# EAGLE design Keypad (EAGLE 7.7.0)

## Sheet 1 of 2
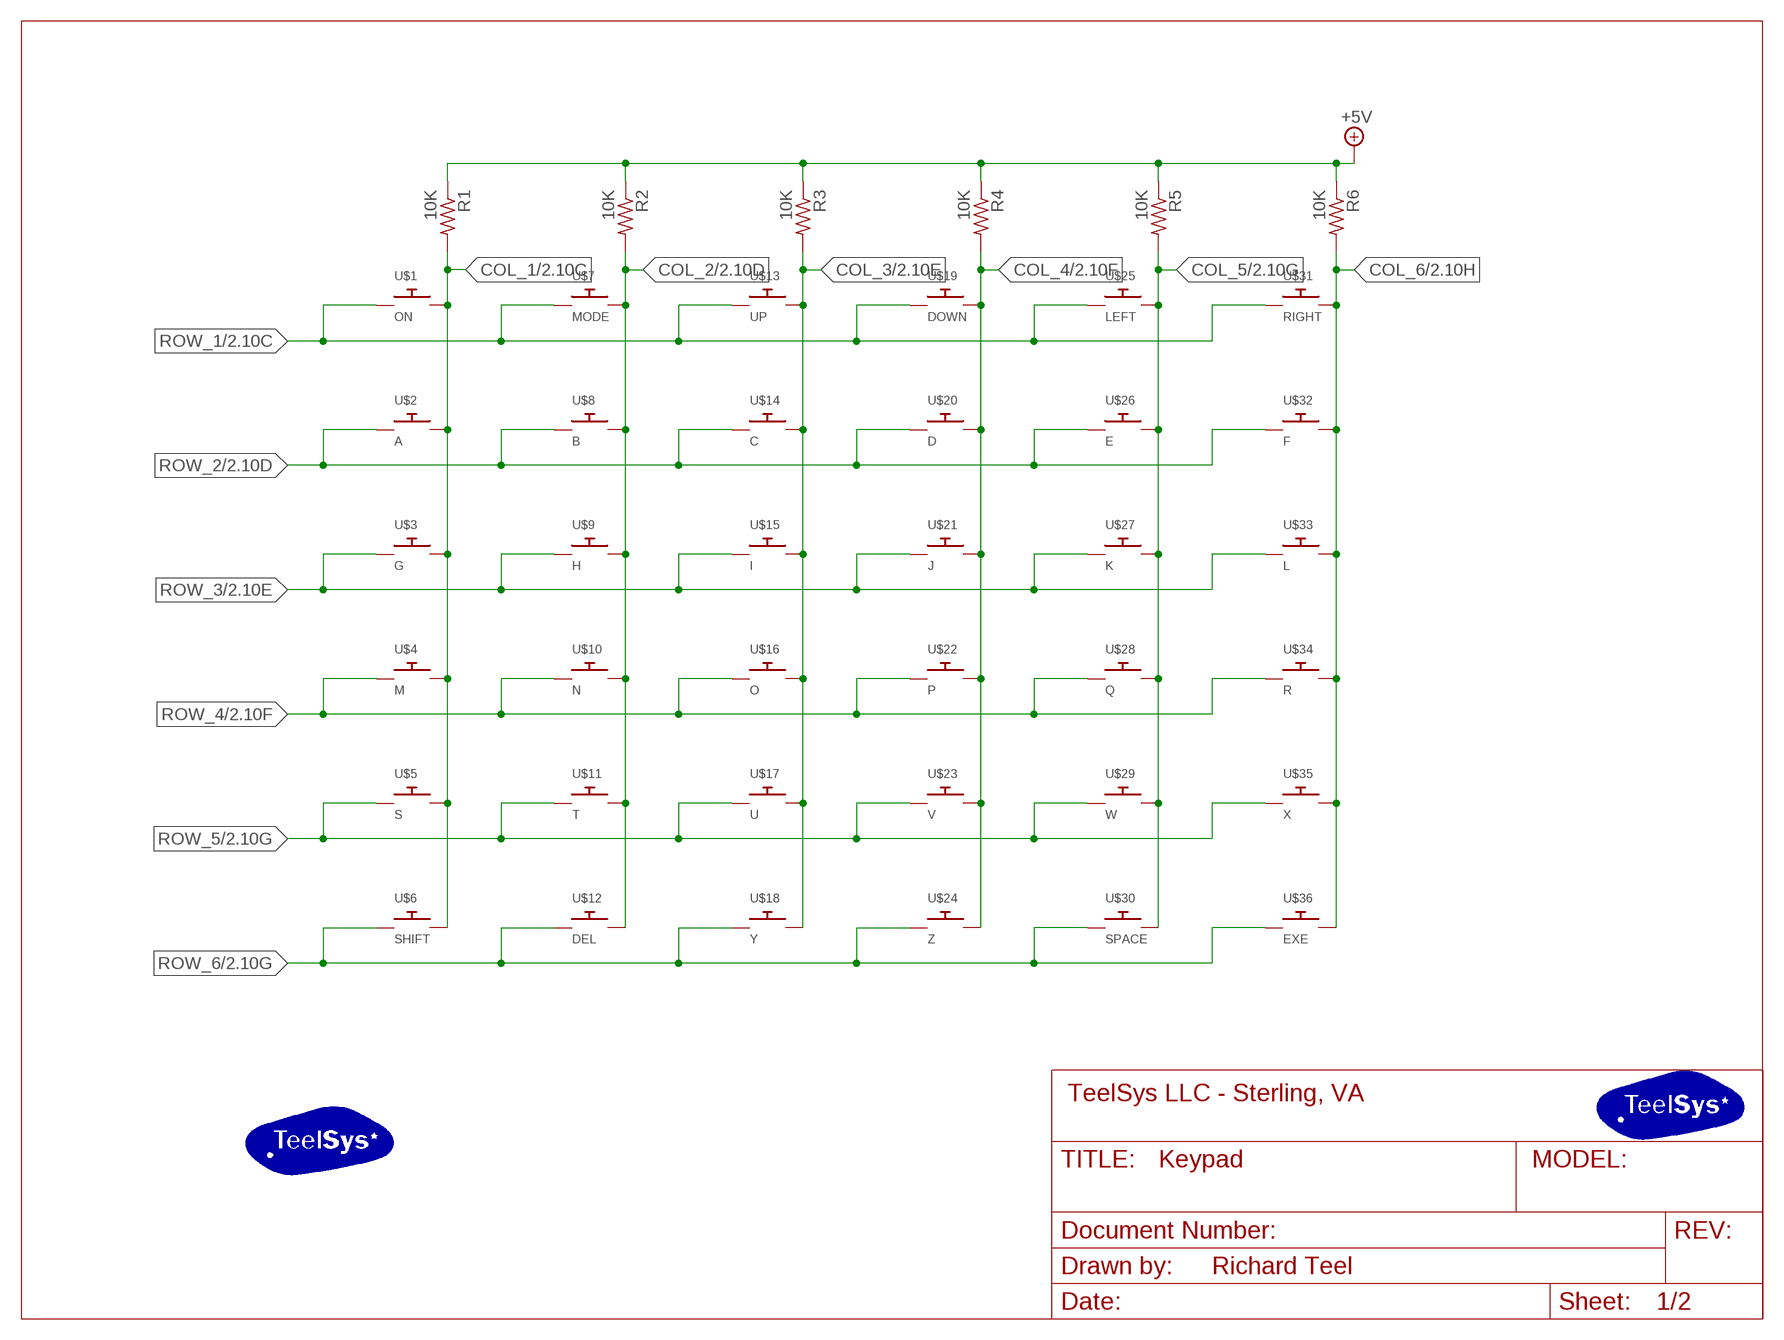
[diagram p0: schematic, sheet 1]
FRAME1 (LETTER_L): COMPANY_INFO: TeelSys LLC - Sterling, VA; DRAWN_BY: Richard Teel

### Parts
R1  10K  R-US_M0805  [M0805]
R2  10K  R-US_M0805  [M0805]
R3  10K  R-US_M0805  [M0805]
R4  10K  R-US_M0805  [M0805]
R5  10K  R-US_M0805  [M0805]
R6  10K  R-US_M0805  [M0805]
U$1  ON  KEYPAD  [KEYPAD_RND]
U$2  A  KEYPAD  [KEYPAD_RND]
U$3  G  KEYPAD  [KEYPAD_RND]
U$4  M  KEYPAD  [KEYPAD_RND]
U$5  S  KEYPAD  [KEYPAD_RND]
U$6  SHIFT  KEYPAD  [KEYPAD_RND]
U$7  MODE  KEYPAD  [KEYPAD_RND]
U$8  B  KEYPAD  [KEYPAD_RND]
U$9  H  KEYPAD  [KEYPAD_RND]
U$10  N  KEYPAD  [KEYPAD_RND]
U$11  T  KEYPAD  [KEYPAD_RND]
U$12  DEL  KEYPAD  [KEYPAD_RND]
U$13  UP  KEYPAD  [KEYPAD_RND]
U$14  C  KEYPAD  [KEYPAD_RND]
U$15  I  KEYPAD  [KEYPAD_RND]
U$16  O  KEYPAD  [KEYPAD_RND]
U$17  U  KEYPAD  [KEYPAD_RND]
U$18  Y  KEYPAD  [KEYPAD_RND]
U$19  DOWN  KEYPAD  [KEYPAD_RND]
U$20  D  KEYPAD  [KEYPAD_RND]
U$21  J  KEYPAD  [KEYPAD_RND]
U$22  P  KEYPAD  [KEYPAD_RND]
U$23  V  KEYPAD  [KEYPAD_RND]
U$24  Z  KEYPAD  [KEYPAD_RND]
U$25  LEFT  KEYPAD  [KEYPAD_RND]
U$26  E  KEYPAD  [KEYPAD_RND]
U$27  K  KEYPAD  [KEYPAD_RND]
U$28  Q  KEYPAD  [KEYPAD_RND]
U$29  W  KEYPAD  [KEYPAD_RND]
U$30  SPACE  KEYPAD  [KEYPAD_RND]
U$31  RIGHT  KEYPAD  [KEYPAD_RND]
U$32  F  KEYPAD  [KEYPAD_RND]
U$33  L  KEYPAD  [KEYPAD_RND]
U$34  R  KEYPAD  [KEYPAD_RND]
U$35  X  KEYPAD  [KEYPAD_RND]
U$36  EXE  KEYPAD  [KEYPAD_RND]
U$40  TEELSYS_LOGO_ART_2BOTTOM  [TEELSYS_LOGO_ART_BOTTOM_2]

### Nets
+5V: R1.1 R2.1 R3.1 R4.1 R5.1 R6.1 ; also sheet 2
COL_1: R1.2 U$1.P$2 U$2.P$2 U$3.P$2 U$4.P$2 U$5.P$2 U$6.P$2 ; also sheet 2
COL_2: R2.2 U$7.P$2 U$8.P$2 U$9.P$2 U$10.P$2 U$11.P$2 U$12.P$2 ; also sheet 2
COL_3: R3.2 U$13.P$2 U$14.P$2 U$15.P$2 U$16.P$2 U$17.P$2 U$18.P$2 ; also sheet 2
COL_4: R4.2 U$19.P$2 U$20.P$2 U$21.P$2 U$22.P$2 U$23.P$2 U$24.P$2 ; also sheet 2
COL_5: R5.2 U$25.P$2 U$26.P$2 U$27.P$2 U$28.P$2 U$29.P$2 U$30.P$2 ; also sheet 2
COL_6: R6.2 U$31.P$2 U$32.P$2 U$33.P$2 U$34.P$2 U$35.P$2 U$36.P$2 ; also sheet 2
ROW_1: U$1.P$1 U$7.P$1 U$13.P$1 U$19.P$1 U$25.P$1 U$31.P$1 ; also sheet 2
ROW_2: U$2.P$1 U$8.P$1 U$14.P$1 U$20.P$1 U$26.P$1 U$32.P$1 ; also sheet 2
ROW_3: U$3.P$1 U$9.P$1 U$15.P$1 U$21.P$1 U$27.P$1 U$33.P$1 ; also sheet 2
ROW_4: U$4.P$1 U$10.P$1 U$16.P$1 U$22.P$1 U$28.P$1 U$34.P$1 ; also sheet 2
ROW_5: U$5.P$1 U$11.P$1 U$17.P$1 U$23.P$1 U$29.P$1 U$35.P$1 ; also sheet 2
ROW_6: U$6.P$1 U$12.P$1 U$18.P$1 U$24.P$1 U$30.P$1 U$36.P$1 ; also sheet 2

## Sheet 2 of 2
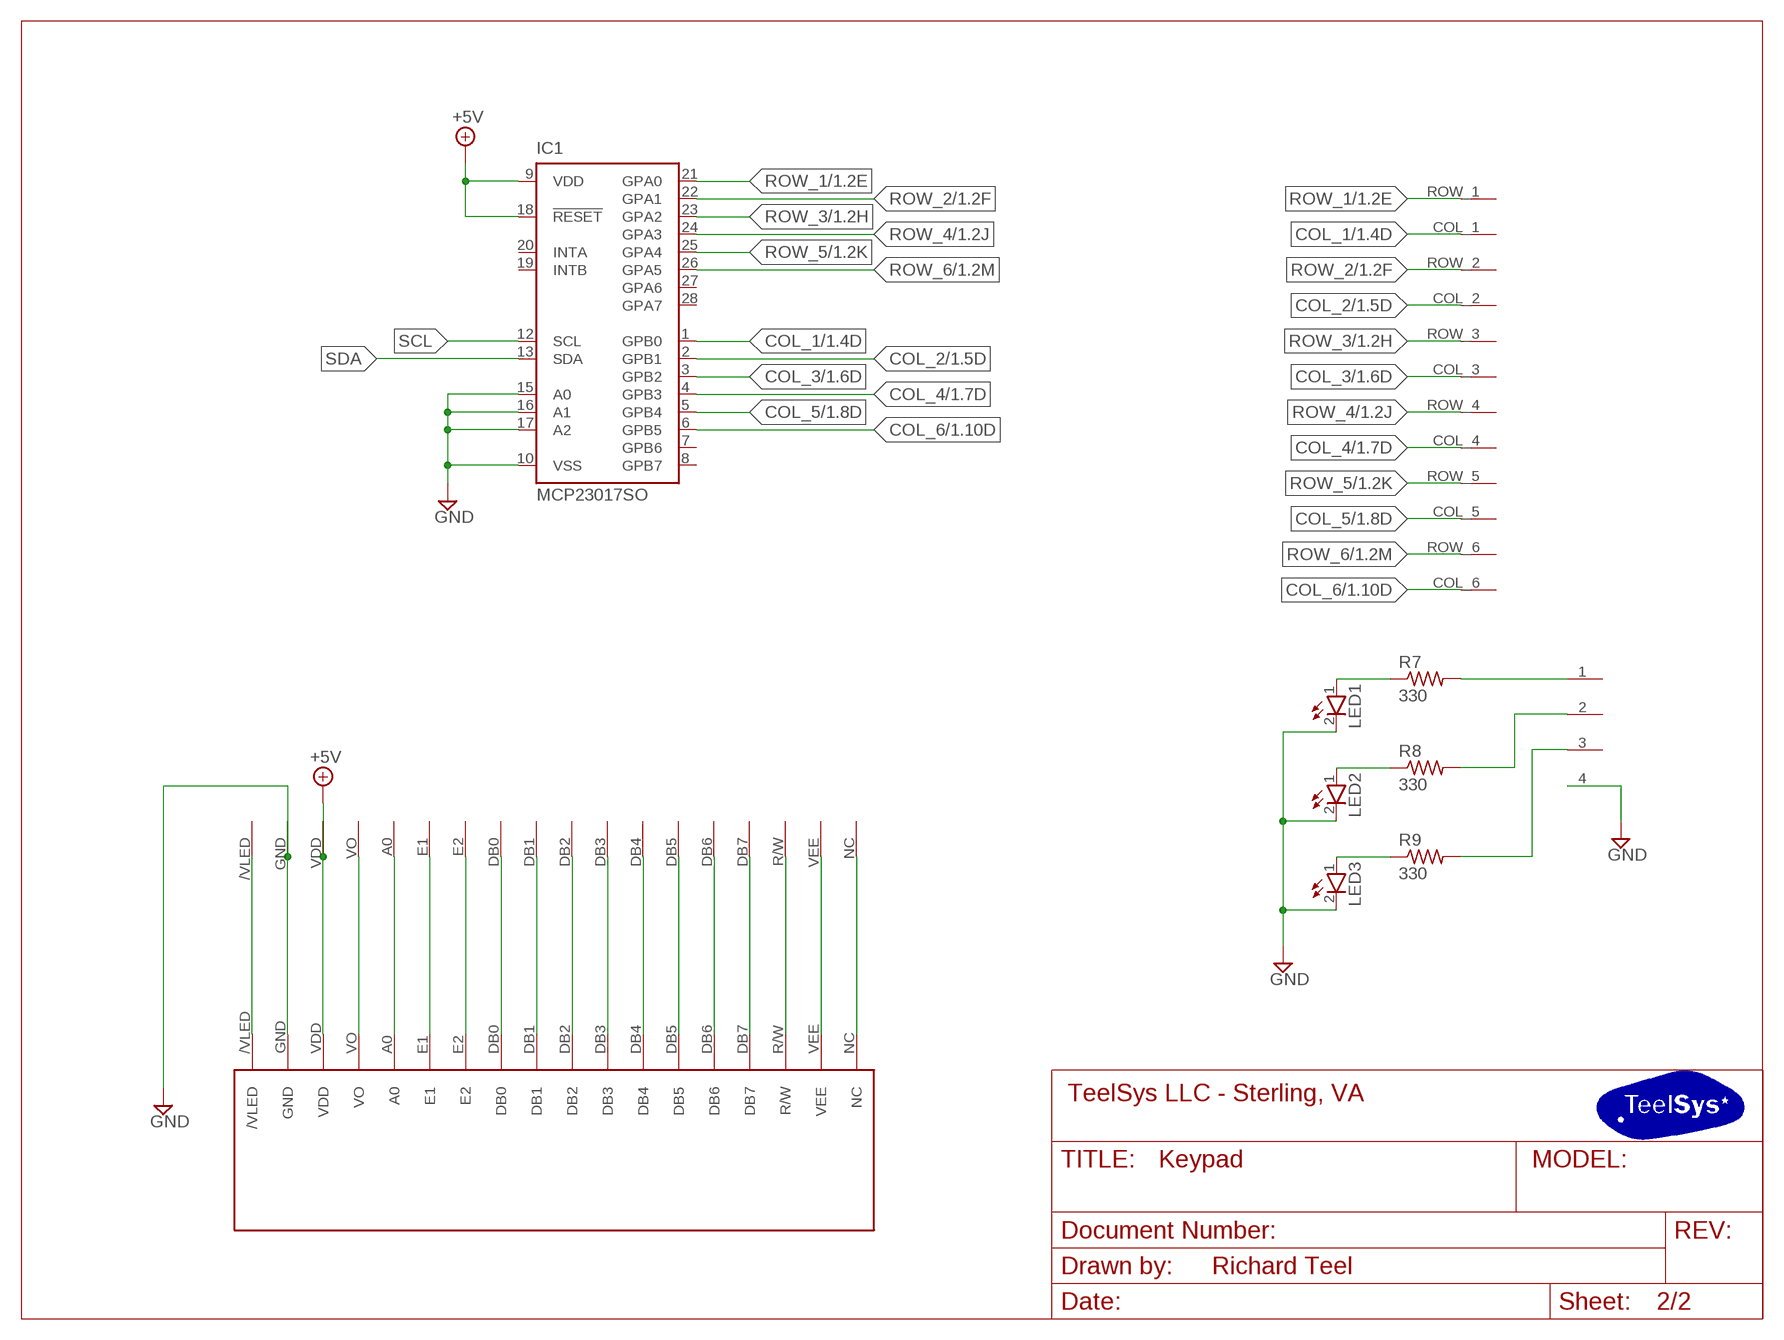
[diagram p1: schematic, sheet 2]
FRAME2 (LETTER_L): COMPANY_INFO: TeelSys LLC - Sterling, VA; DRAWN_BY: Richard Teel

### Parts
IC1  MCP23017SO  [SO28W]
LED1  RED  LED  [HEADER-1X2]
LED2  Green  LED  [HEADER-1X2]
LED3  BLUE  LED  [HEADER-1X2]
R7  330  R-US_M0805  [M0805]
R8  330  R-US_M0805  [M0805]
R9  330  R-US_M0805  [M0805]
U$37  HEADER-1X12-KEYPAD  [HEADER-1X12-KEYPAD]
U$38  HEADER-1X18-LCD  [HEADER-1X18-LCD]
U$39  HEADER-1X4  [HEADER-1X4]
U$73  LCD_CFAL12832A022  [LCD_CFAL12832A022]

### Nets
+5V: IC1.9(VDD) IC1.18(!RESET) U$38.VDD U$73.VDD ; also sheet 1
/VLED: U$38./VLED U$73./VLED
A0: U$38.A0 U$73.A0
COL_1: IC1.1(GPB0) U$37.COL_1 ; also sheet 1
COL_2: IC1.2(GPB1) U$37.COL_2 ; also sheet 1
COL_3: IC1.3(GPB2) U$37.COL_3 ; also sheet 1
COL_4: IC1.4(GPB3) U$37.COL_4 ; also sheet 1
COL_5: IC1.5(GPB4) U$37.COL_5 ; also sheet 1
COL_6: IC1.6(GPB5) U$37.COL_6 ; also sheet 1
DB0: U$38.DB0 U$73.DB0
DB1: U$38.DB1 U$73.DB1
DB2: U$38.DB2 U$73.DB2
DB3: U$38.DB3 U$73.DB3
DB4: U$38.DB4 U$73.DB4
DB5: U$38.DB5 U$73.DB5
DB6: U$38.DB6 U$73.DB6
DB7: U$38.DB7 U$73.DB7
E1: U$38.E1 U$73.E1
E2: U$38.E2 U$73.E2
GND: IC1.10(VSS) IC1.15(A0) IC1.16(A1) IC1.17(A2) LED1.2(K) LED2.2(K) LED3.2(K) U$38.GND U$39.4 U$73.GND
N$1: LED3.1(A) R9.1
N$2: LED2.1(A) R8.1
N$3: LED1.1(A) R7.1
N$4: R9.2 U$39.3
N$5: R8.2 U$39.2
N$6: R7.2 U$39.1
NC: U$38.NC U$73.NC
R/W: U$38.R/W U$73.R/W
ROW_1: IC1.21(GPA0) U$37.ROW_1 ; also sheet 1
ROW_2: IC1.22(GPA1) U$37.ROW_2 ; also sheet 1
ROW_3: IC1.23(GPA2) U$37.ROW_3 ; also sheet 1
ROW_4: IC1.24(GPA3) U$37.ROW_4 ; also sheet 1
ROW_5: IC1.25(GPA4) U$37.ROW_5 ; also sheet 1
ROW_6: IC1.26(GPA5) U$37.ROW_6 ; also sheet 1
SCL: IC1.12(SCL)
SDA: IC1.13(SDA)
VEE: U$38.VEE U$73.VEE
VO: U$38.VO U$73.VO
Unconnected: IC1.7(GPB6) IC1.8(GPB7) IC1.19(INTB) IC1.20(INTA) IC1.27(GPA6) IC1.28(GPA7)

## Library data of the parts
IC1 = microchip:MCP23017: http://ww1.microchip.com/downloads/en/DeviceDoc/21952a.pdf Source: http://ww1.microchip.com/downloads/en/DeviceDoc/21952a.pdf; MF: MICROCHIP; MPN: MCP23017-E/SO; OC_FARNELL: 1332087; OC_NEWARK: 31K2958
LED1-LED3 = teelsys-0.2:LED: LED OSRAM: - CHIPLED LG R971, LG N971, LY N971, LG Q971, LY Q971, LO R971, LY R971 LH N974, LH R974 LS Q976, LO Q976, LY Q976 LO Q996 - Hyper CHIPLED LW Q18S LB Q993, LB Q99A, LB R99A - SideLED LS A670, LO A670, LY A670, LG A670, LP A670 LB A673, LV A673, LT A673, LW A673 LH A674 LY A675 LS A676, LA A676, LO A676, LY A676, LW A676 LS A679, LY A679, LG A679 - Hyper Micro SIDELED® LS Y876, LA Y876, LO Y876, LY Y876 LT Y87S - SmartLED LW L88C, LW L88S LB L89C, LB L89S, LG L890 LS L89K, LO L89K, LY L89K LS L896, LA L896, LO L896, LY L896 - TOPLED LS T670, LO T670, LY T670, LG T670, LP T670 LSG T670, LSP T670, LSY T670, LOP T670, LYG T670 LG T671, LOG T671, LSG T671 LB T673, LV T673, LT T673, LW T673 LH T674 LS T676, LA T676, LO T676, LY T676, LB T676, LH T676, LSB T676, LW T676 LB T67C, LV T67C, LT T67C, LS T67K, LO T67K, LY T67K, LW E67C LS E67B, LA E67B, LO E67B, LY E67B, LB E67C, LV E67C, LT E67C LW T67C LS T679, LY T679, LG T679 LS T770, LO T770, LY T770, LG T770, LP T770 LB T773, LV T773, LT T773, LW T773 LH T774 LS E675, LA E675, LY E675, LS T675 LS T776, LA T776, LO T776, LY T776, LB T776 LHGB T686 LT T68C, LB T68C - Hyper Mini TOPLED® LB M676 - Mini TOPLED Santana® LG M470 LS M47K, LO M47K, LY M47K Source: http://www.osram.convergy.de/
R1-R9 = resistor:R-US_: RESISTOR, American symbol
U$1-U$36 = teelsys-0.2:KEYPAD
U$37 = teelsys-0.2:HEADER-1X12-KEYPAD
U$38 = teelsys-0.2:HEADER-1X18-LCD
U$39 = teelsys-0.2:HEADER-1X4
U$40 = teelsys-0.2:TEELSYS_LOGO_ART_2
U$73 = teelsys-0.2:LCD_CFAL12832A022

## Board
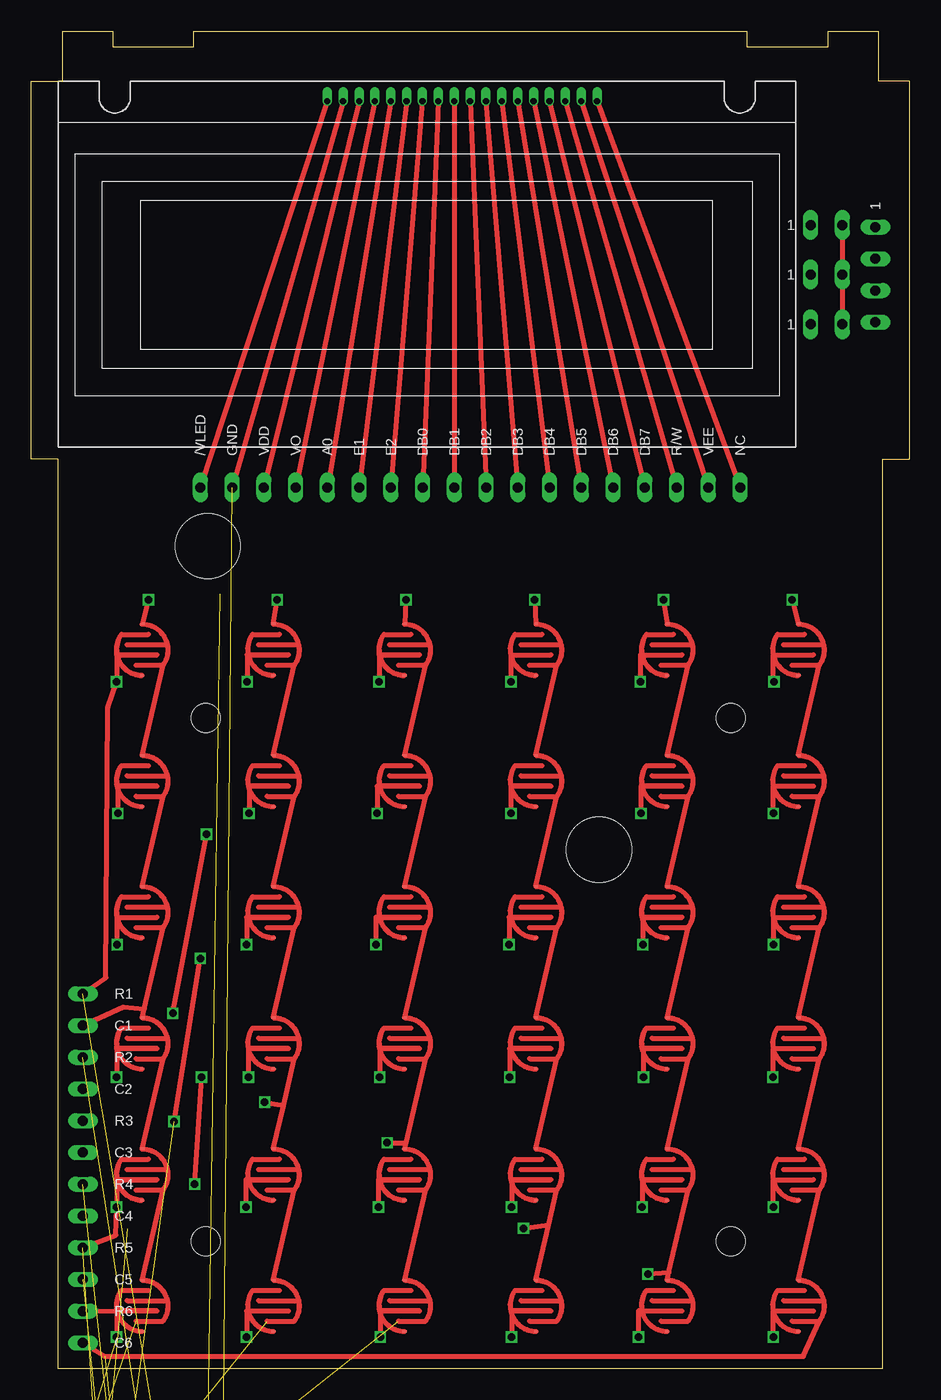
[diagram p2: board, top side]
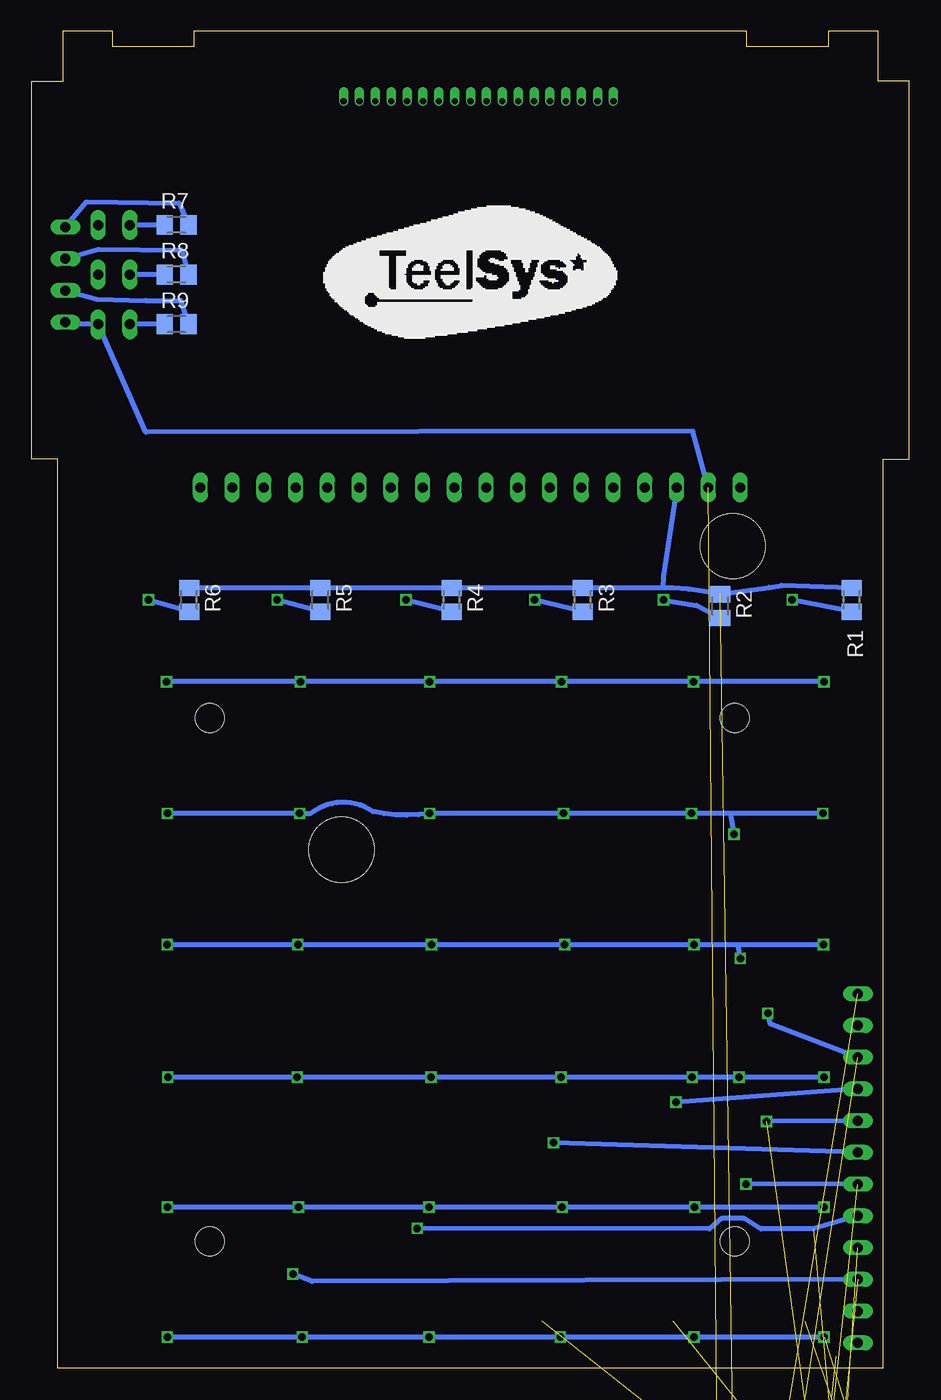
[diagram p3: board, bottom side, seen from below]

Size 70.25 x 107 mm. Coordinates in mm from the lower left corner, seen from the top.
Outline: 2.12,0 68.12,0 68.12,72.75 70.25,72.75 70.25,103 67.75,103 67.75,107 63.75,107 63.75,105.75 57.25,105.75 57.25,107 13,107 13,105.75 6.5,105.75 6.5,107 2.5,107 2.5,103 0,103 0,72.75 2.12,72.75 2.12,0
Copper layers (1*16): Top 0.035559375mm / dielectric 1.6mm / Bottom 0.035559375mm
Design rules "oshpark-2layer2020": minimum track width 6mil, minimum drill 10mil, track to track 6mil, track to pad 6mil, pad to pad 6mil, via to via 6mil, smd to smd 6mil, copper to edge 15mil, drill to drill 6mil, minimum pad ring 5mil, minimum via ring 5mil, stop-mask expansion 2.5mil, vias tented up to drill 0mil, thermal gap 10mil
Holes 2.3 mm at 13.97,52.05 13.97,10.15 55.98,52.05 55.98,10.15
Holes 5.2 mm at 14.12,65.8 45.42,41.5

### Footprints (pad centres in the part's own frame; a part is rotated, then mirrored left to right if it is on the bottom)
SO28W = smd 0.65 x 1.7: 1 -7.62,-4.78; 2 -6.35,-4.78; 3 -5.08,-4.78; 4 -3.81,-4.78; 5 -2.54,-4.78; 6 -1.27,-4.78; 7 0,-4.78; 8 1.27,-4.78; 9 2.54,-4.78; 10 3.81,-4.78; 11 5.08,-4.78; 12 6.35,-4.78; 13 7.62,-4.78; 14 8.89,-4.78; 15 8.89,4.78; 16 7.62,4.78; 17 6.35,4.78; 18 5.08,4.78; 19 3.81,4.78; 20 2.54,4.78; 21 1.27,4.78; 22 0,4.78; 23 -1.27,4.78; 24 -2.54,4.78; 25 -3.81,4.78; 26 -5.08,4.78; 27 -6.35,4.78; 28 -7.62,4.78
HEADER-1X2 = drill 0.8 long: 1 0,1.27; 2 0,-1.27
M0805 = smd 1.3 x 1.6: 1 -0.95,0; 2 0.95,0
KEYPAD_RND = smd 0.305 x 0.152: P$1 0,-2.05; P$2 0,2.05
HEADER-1X12-KEYPAD = drill 0.8 long: COL_1 0,11.43; COL_2 0,6.35; COL_3 0,1.27; COL_4 0,-3.81; COL_5 0,-8.89; COL_6 0,-13.97; ROW_1 0,13.97; ROW_2 0,8.89; ROW_3 0,3.81; ROW_4 0,-1.27; ROW_5 0,-6.35; ROW_6 0,-11.43
HEADER-1X18-LCD = drill 0.8 long: /VLED -21.59,0; A0 -11.43,0; DB0 -3.81,0; DB1 -1.27,0; DB2 1.27,0; DB3 3.81,0; DB4 6.35,0; DB5 8.89,0; DB6 11.43,0; DB7 13.97,0; E1 -8.89,0; E2 -6.35,0; GND -19.05,0; NC 21.59,0; R/W 16.51,0; VDD -16.51,0; VEE 19.05,0; VO -13.97,0
HEADER-1X4 = drill 0.8 long: 1 0,3.81; 2 0,1.27; 3 0,-1.27; 4 0,-3.81
LCD_CFAL12832A022 = drill 0.5 offset: /VLED 21.5,27.7; A0 26.58,27.7; DB0 30.39,27.7; DB1 31.66,27.7; DB2 32.93,27.7; DB3 34.2,27.7; DB4 35.47,27.7; DB5 36.74,27.7; DB6 38.01,27.7; DB7 39.28,27.7; E1 27.85,27.7; E2 29.12,27.7; GND 22.77,27.7; NC 43.09,27.7; R/W 40.55,27.7; VDD 24.07,27.7; VEE 41.82,27.7; VO 25.31,27.7

### Placement (x,y rotation side)
IC1  9.03,-11.6 0 top  (outside the outline)
LED1  63.62,91.5 90 top
LED2  63.62,87.53 90 top
LED3  63.62,83.55 90 top
R1  4.62,61.5 270 bottom
R2  15.12,61 270 bottom
R3  26.12,61.5 270 bottom
R4  36.62,61.5 270 bottom
R5  47.12,61.5 270 bottom
R6  57.62,61.5 270 bottom
R7  58.62,91.5 0 bottom
R8  58.62,87.53 0 bottom
R9  58.62,83.55 0 bottom
U$1  8.88,57.5 0 top
U$2  8.88,47 0 top
U$3  8.88,36.5 0 top
U$4  8.88,26 0 top
U$5  8.88,15.5 0 top
U$6  8.88,5 0 top
U$7  19.38,57.5 0 top
U$8  19.38,47 0 top
U$9  19.38,36.5 0 top
U$10  19.38,26 0 top
U$11  19.38,15.5 0 top
U$12  19.38,5 0 top
U$13  29.88,57.5 0 top
U$14  29.88,47 0 top
U$15  29.88,36.5 0 top
U$16  29.88,26 0 top
U$17  29.88,15.5 0 top
U$18  29.88,5 0 top
U$19  40.38,57.5 0 top
U$20  40.38,47 0 top
U$21  40.38,36.5 0 top
U$22  40.38,26 0 top
U$23  40.38,15.5 0 top
U$24  40.38,5 0 top
U$25  50.88,57.5 0 top
U$26  50.88,47 0 top
U$27  50.88,36.5 0 top
U$28  50.88,26 0 top
U$29  50.88,15.5 0 top
U$30  50.88,5 0 top
U$31  61.38,57.5 0 top
U$32  61.38,47 0 top
U$33  61.38,36.5 0 top
U$34  61.38,26 0 top
U$35  61.38,15.5 0 top
U$36  61.38,5 0 top
U$37  4.12,16 0 top
U$38  35.12,70.5 0 top
U$39  67.53,87.53 0 top
U$40  35.12,87.53 0 top
U$73  2.17,73.7 0 top

### Tracks (layer width: path | path; a pad name or v marks a point on that pad's centre or on a via)
+5V  (2 unrouted)
  Top 0.406: U$73.VDD U$38.VDD
  Bottom 0.406: R6.1 R5.1 R4.1 R3.1 19.73,62.45 | R1.1 10.22,62.65 11.22,62.5 R2.1 17.68,62.35 18.93,62.45 19.73,62.45 | U$38.VDD 19.68,63.35 19.73,62.45
/VLED
  Top 0.406: U$73./VLED U$38./VLED
A0
  Top 0.406: U$73.A0 23.62,69.95 U$38.A0
COL_1  (via drill 0.6)  (1 unrouted)
  Top 0.406: v9.38,61.5 U$1.P$2 | U$2.P$2 10.54,56.27 | U$6.P$2 10.54,14.27 | U$5.P$2 10.54,24.77 | U$4.P$2 9.04,28.78 | 9.04,28.78 10.54,35.27 | U$3.P$2 10.54,45.77 | U$37.COL_1 7.38,28.9 9.04,28.78
  Bottom 0.406: R1.2 v9.38,61.5
COL_2  (via drill 0.6)  (1 unrouted)
  Top 0.406: U$7.P$2 v19.68,61.5 | U$8.P$2 21.05,56.27 | U$11.P$2 20.18,21.05 | 20.18,21.05 21.05,24.77 | U$12.P$2 21.05,14.27 | U$9.P$2 21.05,45.77 | U$10.P$2 21.05,35.27 | v18.68,21.3 20.18,21.05
  Bottom 0.406: v19.68,61.5 17.02,61.05 R2.2 | U$37.COL_2 v18.68,21.3
COL_3  (via drill 0.6)  (1 unrouted)
  Top 0.406: v29.98,61.5 U$13.P$2 | U$14.P$2 31.55,56.27 | U$18.P$2 31.55,14.27 | U$17.P$2 29.99,18.04 | 29.99,18.04 31.55,24.77 | U$16.P$2 31.55,35.27 | U$15.P$2 31.55,45.77 | v28.48,18.05 29.99,18.04
  Bottom 0.406: R3.2 v29.98,61.5 | U$37.COL_3 v28.48,18.05
COL_4  (via drill 0.6)  (1 unrouted)
  Top 0.406: v40.27,61.5 U$19.P$2 | U$20.P$2 42.05,56.27 | U$23.P$2 42.05,24.77 | U$24.P$2 41.4,11.47 | 41.4,11.47 42.05,14.27 | U$22.P$2 42.05,35.27 | U$21.P$2 42.05,45.77 | v39.38,11.2 41.4,11.47
  Bottom 0.406: R4.2 v40.27,61.5 | U$37.COL_4 7.67,11.15 11.88,11.15 13.22,12 15.03,12 15.97,11.15 v39.38,11.2
COL_5  (via drill 0.6)  (1 unrouted)
  Top 0.406: v50.58,61.5 U$25.P$2 | U$26.P$2 52.55,56.27 | U$30.P$2 51.02,7.67 | 51.02,7.67 52.55,14.27 | U$29.P$2 52.55,24.77 | U$27.P$2 52.55,45.77 | U$28.P$2 52.55,35.27 | v49.33,7.55 51.02,7.67
  Bottom 0.406: R5.2 v50.58,61.5 | U$37.COL_5 47.77,6.95 v49.33,7.55
COL_6  (via drill 0.6)  (1 unrouted)
  Top 0.406: v60.88,61.5 U$31.P$2 | U$32.P$2 63.05,56.27 | U$36.P$2 63.05,14.27 | U$35.P$2 63.05,24.77 | U$34.P$2 63.05,35.27 | U$33.P$2 63.05,45.77 | U$37.COL_6 5.88,0.95 61.77,0.95 63.05,3.77
  Bottom 0.406: R6.2 v60.88,61.5
DB0
  Top 0.406: U$73.DB0 U$38.DB0
DB1
  Top 0.406: U$73.DB1 U$38.DB1
DB2
  Top 0.406: U$73.DB2 U$38.DB2
DB3
  Top 0.406: U$73.DB3 U$38.DB3
DB4
  Top 0.406: U$73.DB4 U$38.DB4
DB5
  Top 0.406: U$73.DB5 U$38.DB5
DB6
  Top 0.406: U$73.DB6 U$38.DB6
DB7
  Top 0.406: U$73.DB7 U$38.DB7
E1
  Top 0.406: U$73.E1 U$38.E1
E2
  Top 0.406: U$73.E2 U$38.E2
GND  (4 unrouted)
  Top 0.406: U$73.GND U$38.GND | LED1.2 LED2.2 LED3.2
  Bottom 0.406: U$39.4 67.53,83.55 LED3.2 61.08,74.9 17.32,75 U$38.GND
N$1
  Bottom 0.406: R9.1 LED3.1
N$2
  Bottom 0.406: R8.1 LED2.1
N$3
  Bottom 0.406: R7.1 LED1.1
N$4
  Bottom 0.406: U$39.3 64.97,85.55 61.12,85.45 58.27,85.45 R9.2
N$5
  Bottom 0.406: U$39.2 64.88,89.55 58.23,89.5 R8.2
N$6
  Bottom 0.406: U$39.1 65.83,93.35 58.42,93.25 R7.2
NC
  Top 0.406: U$73.NC U$38.NC
R/W
  Top 0.406: U$73.R/W U$38.R/W
ROW_1  (via drill 0.6)  (1 unrouted)
  Top 0.406: 10.07,57.09 6.83,57.09 v6.83,54.95 6.12,52.9 5.97,31.25 U$37.ROW_1 | v59.42,54.95 59.37,54.95 59.37,57.09 | 20.57,57.09 17.27,57.09 v17.27,54.95 | 48.87,57.09 48.73,57.09 v48.73,54.95 | 38.37,57.09 38.38,57.09 v38.38,54.95 | 31.07,57.09 27.82,57.09 v27.82,54.95
  Bottom 0.406: v6.83,54.95 v17.27,54.95 v27.82,54.95 v38.38,54.95 v48.73,54.95 v59.42,54.95
ROW_2  (via drill 0.6)  (1 unrouted)
  Top 0.406: 10.07,46.59 6.92,46.59 v6.92,44.4 | v59.37,44.4 59.37,46.59 | 20.57,46.59 17.43,46.59 v17.43,44.4 | 31.07,46.59 27.68,46.59 v27.68,44.4 | 41.58,46.59 38.38,46.59 v38.38,44.4 | 52.08,46.59 48.77,46.59 v48.77,44.4 | v11.32,28.4 v14.03,42.75
  Bottom 0.406: v6.92,44.4 14.28,44.4 | 14.28,44.4 v17.43,44.4 v27.68,44.4 v38.38,44.4 arc20 42.92,44.55 arc-73 47.88,44.4 v48.77,44.4 v59.37,44.4 | U$37.ROW_2 11.12,27.55 v11.32,28.4 | v14.03,42.75 14.28,44.4
ROW_3  (via drill 0.6)  (1 unrouted)
  Top 0.406: 59.37,36.09 v59.38,33.9 | v6.88,33.9 6.87,36.09 | 20.57,36.09 17.23,36.09 v17.23,33.9 | 31.07,36.09 27.57,36.09 v27.57,33.9 | 41.58,36.09 38.23,36.09 v38.23,33.9 | 52.08,36.09 48.92,36.09 v48.92,33.9 | v11.43,19.75 v13.53,32.8
  Bottom 0.406: v59.38,33.9 v48.92,33.9 v38.23,33.9 v27.57,33.9 v17.23,33.9 13.68,33.9 | 13.68,33.9 v6.88,33.9 | U$37.ROW_3 v11.43,19.75 | v13.53,32.8 13.68,33.9
ROW_4  (via drill 0.6)  (1 unrouted)
  Top 0.406: 10.07,25.59 6.83,25.59 v6.83,23.3 | v59.33,23.3 59.37,23.3 59.37,25.59 | 20.57,25.59 17.38,25.59 v17.38,23.3 | 31.07,25.59 27.88,25.59 v27.88,23.3 | 41.58,25.59 38.27,25.59 v38.27,23.3 | 52.08,25.59 48.98,25.59 v48.98,23.3 | v13.07,14.75 v13.62,23.3
  Bottom 0.406: v6.83,23.3 v13.62,23.3 13.88,23.3 v17.38,23.3 v27.88,23.3 v38.27,23.3 v48.98,23.3 v59.33,23.3 | U$37.ROW_4 v13.07,14.75
ROW_5  (via drill 0.6)  (1 unrouted)
  Top 0.406: 10.07,15.09 6.83,15.09 v6.83,12.9 6.78,10.65 U$37.ROW_5 | v59.37,12.9 59.37,15.09 | 20.57,15.09 17.18,15.09 v17.18,12.9 | 31.07,15.09 27.77,15.09 v27.77,12.9 | 41.58,15.09 38.42,15.09 v38.42,12.9 | 52.08,15.09 48.88,15.09 v48.88,12.9
  Bottom 0.406: v6.83,12.9 v17.18,12.9 v27.77,12.9 v38.42,12.9 v48.88,12.9 v59.37,12.9
ROW_6  (via drill 0.6)  (1 unrouted)
  Top 0.406: 10.07,4.59 6.83,4.59 | 6.83,4.59 v6.83,2.5 | v59.37,2.5 59.37,4.59 | 48.87,4.59 48.58,4.59 v48.58,2.5 | 17.37,4.59 17.23,4.59 v17.23,2.5 | 31.07,4.59 27.93,4.59 v27.93,2.5 | 41.58,4.59 38.42,4.59 v38.42,2.5 | U$37.ROW_6 6.83,4.59
  Bottom 0.406: v6.83,2.5 v17.23,2.5 v27.93,2.5 v38.42,2.5 v48.58,2.5 v59.37,2.5
VEE
  Top 0.406: U$73.VEE U$38.VEE
VO
  Top 0.406: U$73.VO U$38.VO